# EAGLE schematic Nixie schematic (EAGLE 9.4.0)
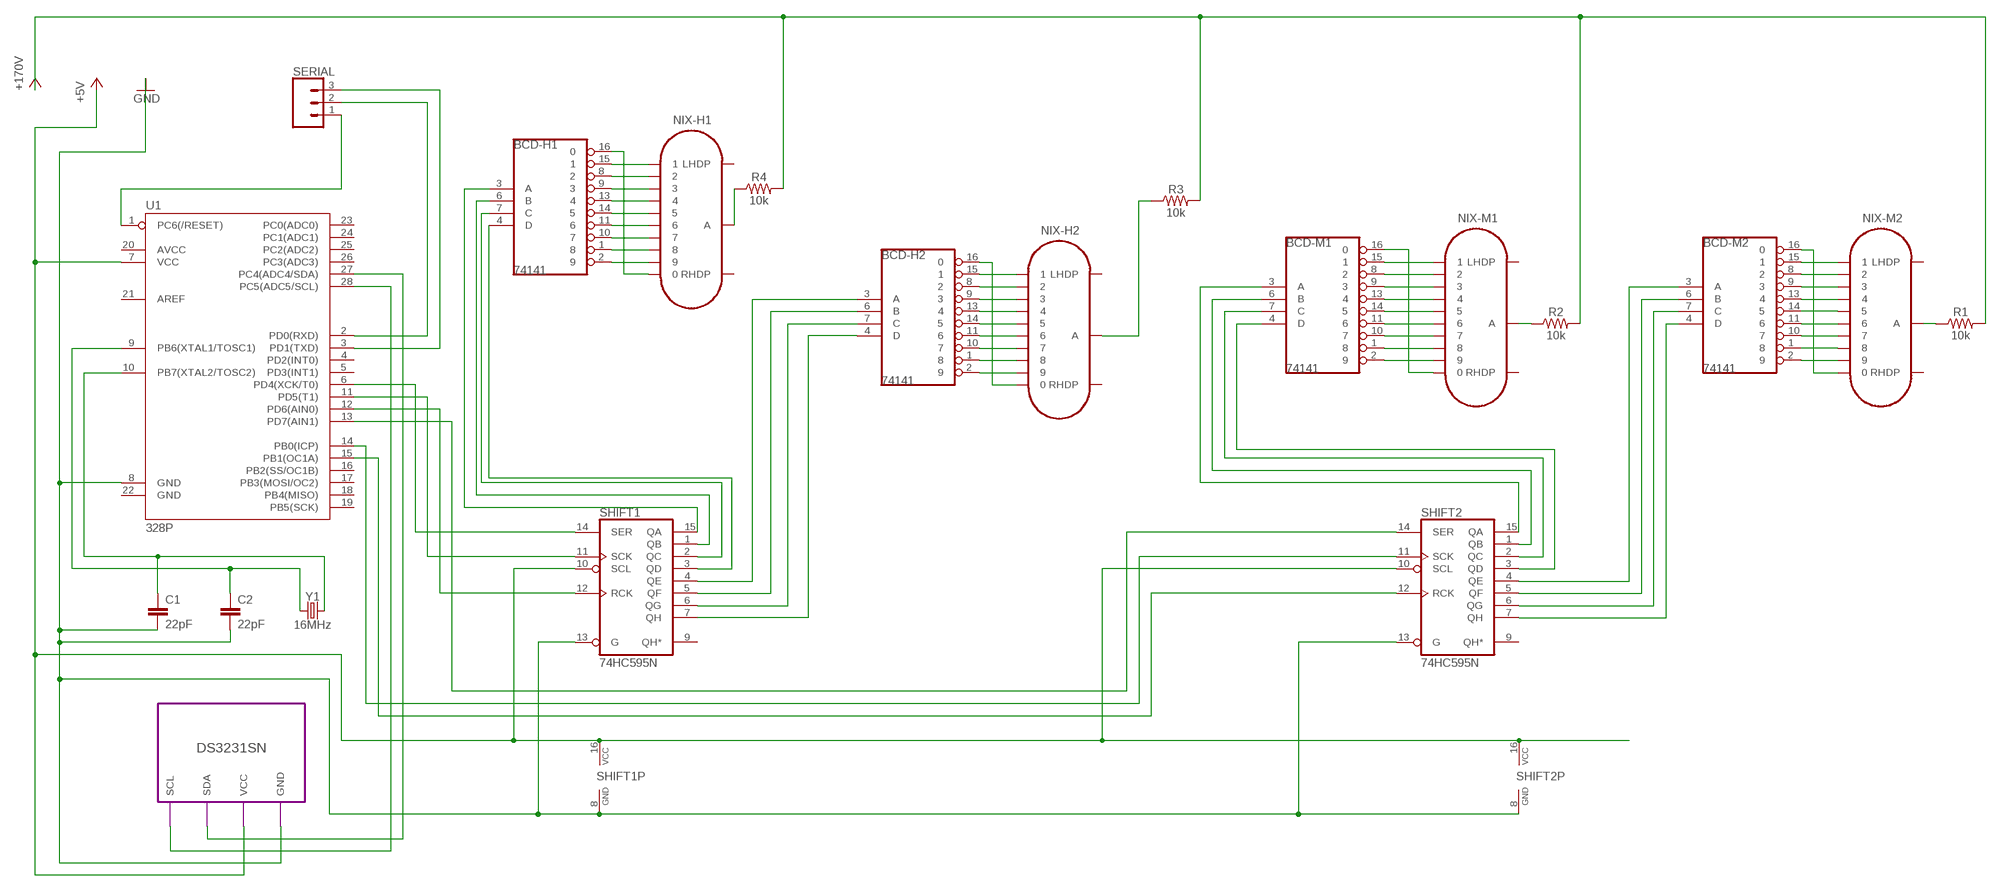
[diagram p0: schematic, sheet 1]

## Parts
BCD-H1  74141  74141N  [DIL16]
BCD-H2  74141  74141N  [DIL16]
BCD-M1  74141  74141N  [DIL16]
BCD-M2  74141  74141N  [DIL16]
C1  22pF  22PF-PTH-2.54MM-200V-5%  [CAP-PTH-2.54]
C2  22pF  22PF-PTH-2.54MM-200V-5%  [CAP-PTH-2.54]
NIX-H1  IN-14  [IN-14]
NIX-H2  IN-14  [IN-14]
NIX-M1  IN-14  [IN-14]
NIX-M2  IN-14  [IN-14]
R1  10k  10KOHM-HORIZ-1/4W-1%  [AXIAL-0.3]
R2  10k  10KOHM-HORIZ-1/4W-1%  [AXIAL-0.3]
R3  10k  10KOHM-HORIZ-1/4W-1%  [AXIAL-0.3]
R4  10k  10KOHM-HORIZ-1/4W-1%  [AXIAL-0.3]
SERIAL  CONN_03  [1X03]
SHIFT1  74HC595N  [DIL16]
SHIFT2  74HC595N  [DIL16]
U1  328P  ATMEGA328P_PDIP  [DIP28]
Y1  16MHz  CRYSTAL-16MHZPTH-HC49US  [HC49US]

## Module instances
DS3231SN = RTC

## Nets
+5V: SHIFT1.10(SCL) SHIFT1.16(VCC) SHIFT2.10(SCL) SHIFT2.16(VCC) U1.7(VCC) ; port DS3231SN.VCC
GND: C1.2 C2.2 SHIFT1.8(GND) SHIFT1.13(G) SHIFT2.8(GND) SHIFT2.13(G) U1.8(GND) ; port DS3231SN.GND
N$1: NIX-M2.A R1.P$1
N$2: NIX-M1.A R2.P$1
N$3: NIX-H2.A R3.P$1
N$4: NIX-H1.A R4.P$1
N$5: C1.1 U1.10(PB7(XTAL2/TOSC2)) Y1.2
N$6: SHIFT1.14(SER) U1.6(PD4(XCK/T0))
N$7: SHIFT1.11(SCK) U1.11(PD5(T1))
N$8: C2.1 U1.9(PB6(XTAL1/TOSC1)) Y1.1
N$9: U1.27(PC4(ADC4/SDA)) ; port DS3231SN.SDA
N$10: U1.28(PC5(ADC5/SCL)) ; port DS3231SN.SCL
N$11: SHIFT1.12(RCK) U1.12(PD6(AIN0))
N$12: SHIFT2.14(SER) U1.13(PD7(AIN1))
N$13: SHIFT2.11(SCK) U1.14(PB0(ICP))
N$14: SHIFT2.12(RCK) U1.15(PB1(OC1A))
N$15: SERIAL.1 U1.1(PC6(/RESET))
N$16: SERIAL.2 U1.2(PD0(RXD))
N$17: SERIAL.3 U1.3(PD1(TXD))
N$18: BCD-H1.3(A) SHIFT1.15(QA)
N$19: BCD-H1.6(B) SHIFT1.1(QB)
N$20: BCD-H1.7(C) SHIFT1.2(QC)
N$21: BCD-H1.4(D) SHIFT1.3(QD)
N$22: BCD-H2.3(A) SHIFT1.4(QE)
N$23: BCD-H2.6(B) SHIFT1.5(QF)
N$24: BCD-H2.7(C) SHIFT1.6(QG)
N$25: BCD-H2.4(D) SHIFT1.7(QH)
N$26: BCD-M1.3(A) SHIFT2.15(QA)
N$27: BCD-M1.6(B) SHIFT2.1(QB)
N$28: BCD-M1.7(C) SHIFT2.2(QC)
N$29: BCD-M1.4(D) SHIFT2.3(QD)
N$30: BCD-M2.3(A) SHIFT2.4(QE)
N$31: BCD-M2.6(B) SHIFT2.5(QF)
N$32: BCD-M2.7(C) SHIFT2.6(QG)
N$33: BCD-M2.4(D) SHIFT2.7(QH)
N$34: BCD-H1.15 NIX-H1.1
N$35: BCD-H1.8 NIX-H1.2
N$36: BCD-H1.9 NIX-H1.3
N$37: BCD-H1.13 NIX-H1.4
N$38: BCD-H1.14 NIX-H1.5
N$39: BCD-H1.11 NIX-H1.6
N$40: BCD-H1.10 NIX-H1.7
N$41: BCD-H1.1 NIX-H1.8
N$42: BCD-H1.2 NIX-H1.9
N$43: BCD-H1.16 NIX-H1.0
N$44: BCD-H2.15 NIX-H2.1
N$45: BCD-H2.8 NIX-H2.2
N$46: BCD-H2.9 NIX-H2.3
N$47: BCD-H2.13 NIX-H2.4
N$48: BCD-H2.14 NIX-H2.5
N$49: BCD-H2.11 NIX-H2.6
N$50: BCD-H2.10 NIX-H2.7
N$51: BCD-H2.1 NIX-H2.8
N$52: BCD-H2.2 NIX-H2.9
N$53: BCD-H2.16 NIX-H2.0
N$54: BCD-M1.15 NIX-M1.1
N$55: BCD-M1.8 NIX-M1.2
N$56: BCD-M1.9 NIX-M1.3
N$57: BCD-M1.13 NIX-M1.4
N$58: BCD-M1.14 NIX-M1.5
N$59: BCD-M1.11 NIX-M1.6
N$60: BCD-M1.10 NIX-M1.7
N$61: BCD-M1.1 NIX-M1.8
N$62: BCD-M1.2 NIX-M1.9
N$63: BCD-M1.16 NIX-M1.0
N$64: BCD-M2.15 NIX-M2.1
N$65: BCD-M2.8 NIX-M2.2
N$66: BCD-M2.9 NIX-M2.3
N$67: BCD-M2.13 NIX-M2.4
N$68: BCD-M2.14 NIX-M2.5
N$69: BCD-M2.11 NIX-M2.6
N$70: BCD-M2.10 NIX-M2.7
N$71: BCD-M2.1 NIX-M2.8
N$72: BCD-M2.2 NIX-M2.9
N$73: BCD-M2.16 NIX-M2.0
VCC: R1.P$2 R2.P$2 R3.P$2 R4.P$2 ; supply symbol labelled +170V
Unconnected: NIX-H1.LHDP NIX-H1.RHDP NIX-H2.LHDP NIX-H2.RHDP NIX-M1.LHDP NIX-M1.RHDP NIX-M2.LHDP NIX-M2.RHDP SHIFT1.9(QH*) SHIFT2.9(QH*) U1.4(PD2(INT0)) U1.5(PD3(INT1)) U1.16(PB2(SS/OC1B)) U1.17(PB3(MOSI/OC2)) U1.18(PB4(MISO)) U1.19(PB5(SCK)) U1.20(AVCC) U1.21(AREF) U1.22(GND) U1.23(PC0(ADC0)) U1.24(PC1(ADC1)) U1.25(PC2(ADC2)) U1.26(PC3(ADC3))

## Power pins joined to a net without a drawn wire
GND: BCD-H1.12(GND) BCD-H2.12(GND) BCD-M1.12(GND) BCD-M2.12(GND)
VCC: BCD-H1.5(VCC) BCD-H2.5(VCC) BCD-M1.5(VCC) BCD-M2.5(VCC)

## Library data of the parts
BCD-H1 BCD-H2 BCD-M1 BCD-M2 = 74xx-eu:74*141: BCD to decimal DECODER/DRIVER
C1 C2 = SparkFun-Capacitors:22PF: 22pF ceramic capacitors A capacitor is a passive two-terminal electrical component used to store electrical energy temporarily in an electric field.; PROD_ID: CAP-09128
NIX-H1 NIX-H2 NIX-M1 NIX-M2 = nixies-us:IN-14: IN-14: medium numeric frontview nixie tube
R1-R4 = SparkFun-Resistors:10KOHM: 10kΩ resistor A resistor is a passive two-terminal electrical component that implements electrical resistance as a circuit element. Resistors act to reduce current flow, and, at the same time, act to lower voltage levels within circuits. - Wikipedia; PROD_ID: RES-12183
SERIAL = SparkFun-Connectors:CONN_03: Multi connection point. Often used as Generic Header-pin footprint for 0.1 inch spaced/style header connections On any of the 0.1 inch spaced packages, you can populate with these: Break Away Headers - Straight <https://www.sparkfun.com/products/116> (PRT-00116) Break Away Male Headers - Right Angle <https://www.sparkfun.com/products/553> (PRT-00553) Female Headers <https://www.sparkfun.com/products/115> (PRT-00115) Break Away Headers - Machine Pin <https://www.sparkfun.com/products/117> (PRT-00117) Break Away Female Headers - Swiss Machine Pin <https://www.sparkfun.com/products/743> (PRT-00743) Stackable Header - 3 Pin (Female, 0.1") <https://www.sparkfun.com/products/13875> (PRT-13875) For SCREWTERMINALS and SPRING TERMINALS visit here: Screw Terimnals on SparkFun.com <https://www.sparkfun.com/search/results?term=Screw+Terminals> (5mm/3.5mm/2.54mm spacing) This device is also useful as a general connection point to wire up your design to another part of your project. Our various solder wires solder well into these plated through hole pads. Hook-Up Wire - Assortment (Stranded, 22 AWG) <https://www.sparkfun.com/products/11375> (PRT-11375) Hook-Up Wire - Assortment (Solid Core, 22 AWG) <https://www.sparkfun.com/products/11367> (PRT-11367) View the entire wire category on our website here <https://www.sparkfun.com/categories/141> Special notes: Molex polarized connector foot print use with SKU : PRT-08232 with associated crimp pins and housings.
SHIFT1 SHIFT2 = 74xx-eu:74*595: 8-bit SHIFT REGISTER, output latch
U1 = SparkFun-IC-Microcontroller:ATMEGA328P_PDIP: Atmel 328P Through hole ATMEGA328P uC used in the Arduino 32kb flash, 1k EEPROM, 2k SRAM Datasheet <http://www.sparkfun.com/datasheets/Components/SMD/ATMega328.pdf> SparkFun Products Storefront component: AVR 28 Pin 20MHz 32K 6A/D - ATMega328P <https://www.sparkfun.com/products/9061> (COM-09061) SparkFun Simon Says - Through-Hole Soldering Kit <https://www.sparkfun.com/products/10547> (KIT-10547) SparkFun Learn to Solder - Simon Says <https://www.sparkfun.com/products/13708> (KIT-13708) SparkFun BigTime Watch Kit <https://www.sparkfun.com/products/11734> (KIT-11734) SparkFun ClockIt <https://www.sparkfun.com/products/10930> (KIT-10930) SparkFun Serial Enabled LCD Kit <https://www.sparkfun.com/products/10097> (LCD-10097) SparkFun Simon Tilts - Through Hole Soldering Kit <https://www.sparkfun.com/products/12634> (KIT-12634) SparkFun Frequency Counter Kit <https://www.sparkfun.com/products/10140> (KIT-10140) FabFM Radio Kit <https://www.sparkfun.com/products/11043> (KIT-11043) SparkFun Binary Blaster Kit <https://www.sparkfun.com/products/12037> (KIT-12037) SparkFun Metro-Gnome <https://www.sparkfun.com/products/9236> (KIT-09236) ATmega328 with Arduino Optiboot (Uno) <https://www.sparkfun.com/products/10524> (DEV-10524); PROD_ID: IC-09136
Y1 = SparkFun-Clocks:CRYSTAL-16MHZ: 16MHz Crystal Digikey Example <http://www.digikey.com/product-search/en?keywords=535-9122-1-ND> Frequency: 16MHz Frequency Stability: ±50ppm Frequency Tolerance: ±20ppm Load Capacitance: 18pF SparkFun Products: Pro Micro -5V/16MHz <https://www.sparkfun.com/products/12640> SparkFun Serial Enabled LCD Kit <https://www.sparkfun.com/products/10097>; PROD_ID: XTAL-08181; SF_ID: COM-00536

## Module RTC
Ports: SCL(io) SDA(io) VCC(io) GND(io)

### Library data of the parts